# Altium schematic sheet B293B Top.SchDoc
size A4
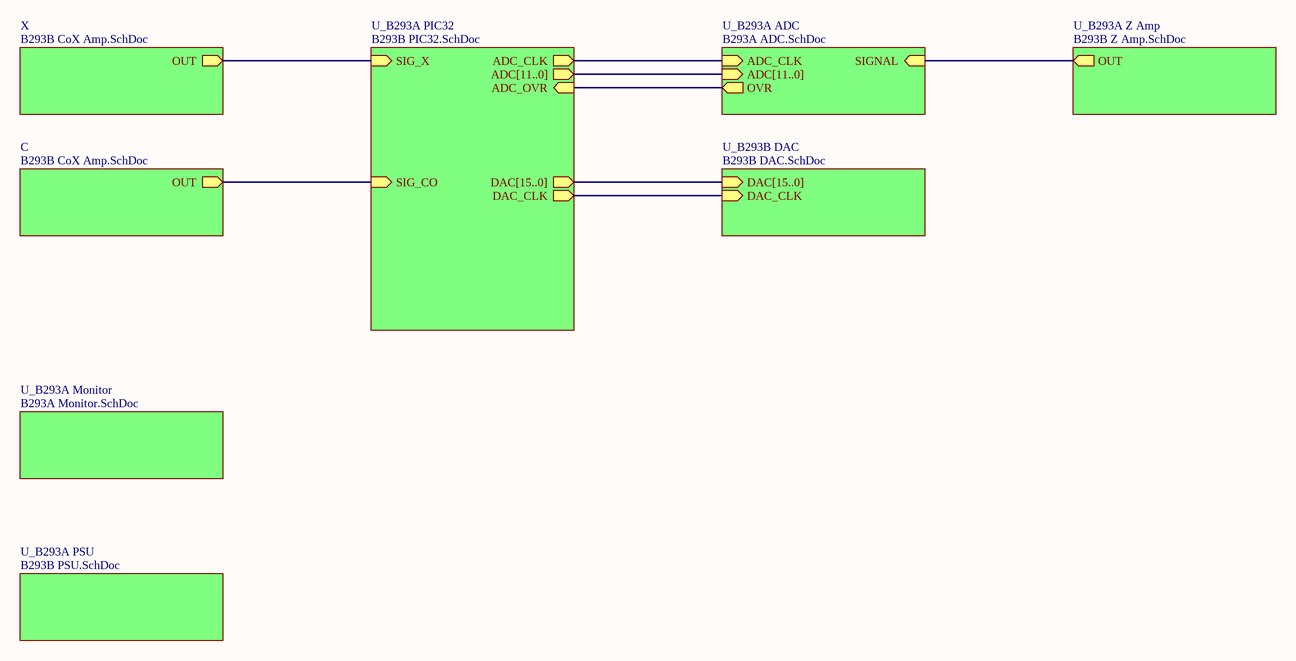
[diagram p0: B293B Top.SchDoc]

## Sub-sheets
C = B293B CoX Amp.SchDoc: OUT (out)
U_B293A ADC = B293A ADC.SchDoc: ADC_CLK (in), ADC[11..0] (in), OVR (out), SIGNAL (in)
U_B293A Monitor = B293A Monitor.SchDoc: no entries
U_B293A PIC32 = B293B PIC32.SchDoc: ADC_CLK (out), ADC[11..0] (out), ADC_OVR (in), DAC[15..0] (out), DAC_CLK (out), SIG_X (in), SIG_CO (in)
U_B293A PSU = B293B PSU.SchDoc: no entries
U_B293A Z Amp = B293B Z Amp.SchDoc: OUT (out)
U_B293B DAC = B293B DAC.SchDoc: DAC[15..0] (in), DAC_CLK (in)
X = B293B CoX Amp.SchDoc: OUT (out)

## Nets
(unnamed): sheet U_B293A ADC/ADC_CLK, sheet U_B293A PIC32/ADC_CLK
(unnamed): sheet U_B293A ADC/OVR, sheet U_B293A PIC32/ADC_OVR
(unnamed): sheet U_B293A ADC/SIGNAL, sheet U_B293A Z Amp/OUT
(unnamed): sheet U_B293B DAC/DAC_CLK, sheet U_B293A PIC32/DAC_CLK
(unnamed): sheet U_B293A PIC32/SIG_X, sheet X/OUT
(unnamed): sheet U_B293A PIC32/SIG_CO, sheet C/OUT

## Buses and harness runs
bus sheet U_B293A ADC/ADC[11..0] = sheet U_B293A PIC32/ADC[11..0]
bus sheet U_B293A PIC32/DAC[15..0] = sheet U_B293B DAC/DAC[15..0]